# EAGLE design svd (EAGLE 6.6.0)
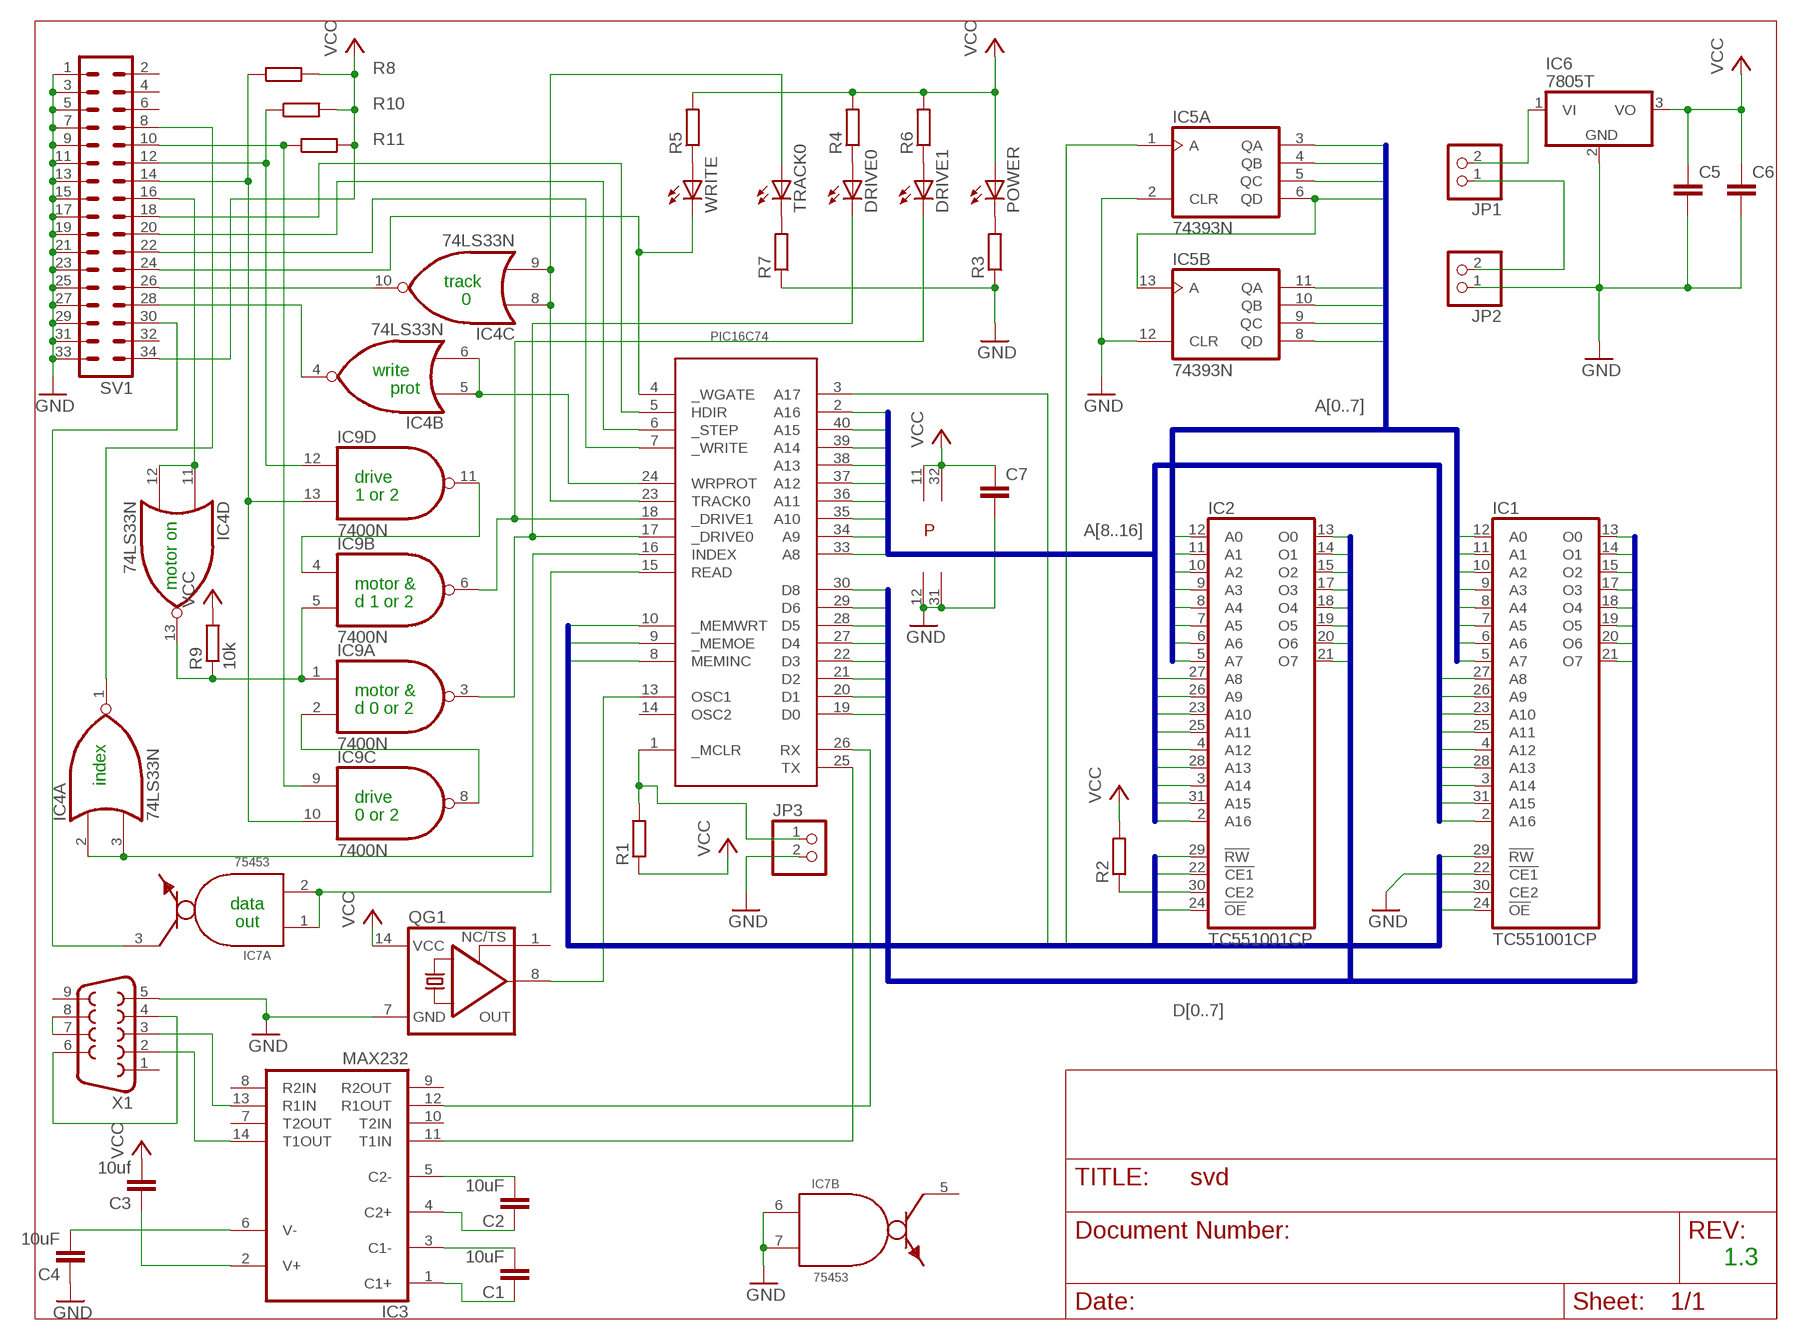
[diagram p0: schematic, sheet 1]

## Parts
C1  10uF  C2.5/5  [C2.5-5]
C2  10uF  C2.5/5  [C2.5-5]
C3  10uf  C2.5/5  [C2.5-5]
C4  10uF  C2.5/5  [C2.5-5]
C5  C5/5  [C5B5]
C6  C5/5  [C5B5]
C7  C2,5-3  [C2.5-3]
DRIVE0  LED3MM  [LED3MM]
DRIVE1  LED3MM  [LED3MM]
IC1  TC551001CP  [DIL32]
IC2  TC551001CP  [DIL32]
IC3  MAX232  [DIL16]
IC4  74LS33N  [DIL14]
IC5  74393N  [DIL14]
IC6  7805T  [TO220H]
IC7  75453  [DIL08]
IC9  7400N  [DIL14]
JP1  PINHD-1X2  [1X02]
JP2  PINHD-1X2  [1X02]
JP3  PINHD-1X2  [1X02]
PIC16C74  SVD-PIC16C74  [DIL40]
POWER  LED3MM  [LED3MM]
QG1  XO-14  [DIL14S]
R1  R-EU_0204/5  [0204/5]
R2  R-EU_0204/5  [0204/5]
R3  R-EU_0204/5  [0204/5]
R4  R-EU_0204/5  [0204/5]
R5  R-EU_0204/5  [0204/5]
R6  R-EU_0204/5  [0204/5]
R7  R-EU_0204/5  [0204/5]
R8  R-EU_0204/5  [0204/5]
R9  10k  R-EU_0204/5  [0204/5]
R10  R-EU_0204/5  [0204/5]
R11  R-EU_0204/5  [0204/5]
SV1  ML34  [ML34]
TRACK0  LED3MM  [LED3MM]
WRITE  LED3MM  [LED3MM]
X1  F09HP  [F09HP]

## Nets
!OE: IC1.24(!OE) IC2.24(!OE) PIC16C74.9(_MEMOE)
!WE: IC1.29(!RW) IC2.29(!RW) PIC16C74.10(_MEMWRT)
A0: IC1.12(A0) IC2.12(A0) IC5.3(A:QA)
A1: IC1.11(A1) IC2.11(A1) IC5.4(A:QB)
A2: IC1.10(A2) IC2.10(A2) IC5.5(A:QC)
A3: IC1.9(A3) IC2.9(A3) IC5.6(A:QD) IC5.13(B:A)
A4: IC1.8(A4) IC2.8(A4) IC5.11(B:QA)
A5: IC1.7(A5) IC2.7(A5) IC5.10(B:QB)
A6: IC1.6(A6) IC2.6(A6) IC5.9(B:QC)
A7: IC1.5(A7) IC2.5(A7) IC5.8(B:QD)
A8: IC1.27(A8) IC2.27(A8) PIC16C74.33(A8)
A9: IC1.26(A9) IC2.26(A9) PIC16C74.34(A9)
A10: IC1.23(A10) IC2.23(A10) PIC16C74.35(A10)
A11: IC1.25(A11) IC2.25(A11) PIC16C74.36(A11)
A12: IC1.4(A12) IC2.4(A12) PIC16C74.37(A12)
A13: IC1.28(A13) IC2.28(A13) PIC16C74.38(A13)
A14: IC1.3(A14) IC2.3(A14) PIC16C74.39(A14)
A15: IC1.31(A15) IC2.31(A15) PIC16C74.40(A15)
A16: IC1.2(A16) IC2.2(A16) PIC16C74.2(A16)
A17: IC1.30(CE2) IC2.22(!CE1) PIC16C74.3(A17)
CLK: IC5.1(A:A) PIC16C74.8(MEMINC)
D0: IC1.13(O0) IC2.13(O0) PIC16C74.19(D0)
D1: IC1.14(O1) IC2.14(O1) PIC16C74.20(D1)
D2: IC1.15(O2) IC2.15(O2) PIC16C74.21(D2)
D3: IC1.17(O3) IC2.17(O3) PIC16C74.22(D3)
D4: IC1.18(O4) IC2.18(O4) PIC16C74.27(D4)
D5: IC1.19(O5) IC2.19(O5) PIC16C74.28(D5)
D6: IC1.20(O6) IC2.20(O6) PIC16C74.29(D6)
D7: IC1.21(O7) IC2.21(O7) PIC16C74.30(D8)
GND: C4.1 C5.2 C6.2 C7.2 IC1.22(!CE1) IC5.2(A:CLR) IC5.12(B:CLR) IC6.2(GND) IC7.6(B:I0) IC7.7(B:I1) JP2.1 JP3.2 PIC16C74.12(GND) PIC16C74.31(GND) QG1.7(GND) R3.1 R7.1 SV1.1 SV1.3 SV1.5 SV1.7 SV1.9 SV1.11 SV1.13 SV1.15 SV1.17 SV1.19 SV1.21 SV1.23 SV1.25 SV1.27 SV1.29 SV1.31 SV1.33 X1.5
N$1: IC2.30(CE2) R2.1
N$2: JP3.1 PIC16C74.1(_MCLR) R1.2
N$3: C1.1 IC3.1(C1+)
N$4: C1.2 IC3.3(C1-)
N$5: C2.1 IC3.4(C2+)
N$6: C2.2 IC3.5(C2-)
N$7: C3.1 IC3.2(V+)
N$8: PIC16C74.13(OSC1) QG1.8(OUT)
N$9: IC3.12(R1OUT) PIC16C74.26(RX)
N$10: DRIVE1.K(C) IC9.6(B:O) PIC16C74.18(_DRIVE1)
N$11: IC4.11(D:I0) IC4.12(D:I1) SV1.16
N$12: IC9.12(D:I0) R10.1 SV1.12
N$13: IC4.13(D:O) IC9.1(A:I0) IC9.5(B:I1) R9.1
N$14: IC4.1(A:O) SV1.8
N$15: PIC16C74.4(_WGATE) SV1.24 WRITE.K(C)
N$16: PIC16C74.7(_WRITE) SV1.22
N$17: IC4.10(C:O) SV1.26
N$18: X1.7 X1.8
N$19: IC7.1(A:I0) IC7.2(A:I1) PIC16C74.15(READ)
N$20: IC9.4(B:I0) IC9.11(D:O)
N$22: IC4.8(C:I0) IC4.9(C:I1) PIC16C74.23(TRACK0) TRACK0.A
N$23: DRIVE0.K(C) IC9.3(A:O) PIC16C74.17(_DRIVE0)
N$24: IC3.11(T1IN) PIC16C74.25(TX)
N$25: IC3.13(R1IN) X1.3
N$26: X1.4 X1.6
N$27: IC3.14(T1OUT) X1.2
N$28: C4.2 IC3.6(V-)
N$29 [Output]: IC4.2(A:I0) IC4.3(A:I1) PIC16C74.16(INDEX)
N$30 [VCC]: IC6.1(VI) JP1.2
N$32: POWER.K(C) R3.2
N$33: DRIVE0.A R4.1
N$34: DRIVE1.A R6.1
N$35: R5.1 WRITE.A
N$36: R7.2 TRACK0.K(C)
N$38 [VCC]: JP1.1 JP2.2
N$40 [Output]: IC7.3(A:O) SV1.30
N$41: IC4.5(B:I0) IC4.6(B:I1) PIC16C74.24(WRPROT)
N$42: IC9.9(C:I0) R11.1 SV1.10
N$43: IC9.2(A:I1) IC9.8(C:O)
N$45: IC4.4(B:O) SV1.28
N$47: PIC16C74.6(_STEP) SV1.20
N$48: PIC16C74.5(HDIR) SV1.18
N$51: IC9.10(C:I1) IC9.13(D:I1) R8.1 SV1.14
VCC [VCC]: C3.2 C5.1 C6.1 C7.1 IC6.3(VO) PIC16C74.11(VCC) PIC16C74.32(VCC) POWER.A QG1.14(VCC) R1.1 R2.2 R4.2 R5.2 R6.2 R8.2 R9.2 R10.2 R11.2 SV1.34
Unconnected: IC1.1(NC) IC2.1(NC) IC3.7(T2OUT) IC3.8(R2IN) IC3.9(R2OUT) IC3.10(T2IN) IC7.5(B:O) PIC16C74.14(OSC2) QG1.1(TS) SV1.2 SV1.4 SV1.6 SV1.32 X1.1 X1.9

## Buses
D[0..7]
A[0..7]
A[8..16]
A17,!OE,!WE,CLK

## Notes on the sheet
- track
- 0
- write
- prot
- drive
- 1 or 2
- motor on | motor &
- d 1 or 2
- motor &
- d 0 or 2
- index
- drive
- 0 or 2
- data
- out
- 1.3

## Power pins joined to a net without a drawn wire
GND: IC1.16(GND) IC2.16(GND) IC3.15(GND) IC4.7(P:GND) IC5.7(P:GND) IC7.4(P:GND) IC9.7(P:GND)
VCC: IC1.32(VCC) IC2.32(VCC) IC3.16(VCC) IC4.14(P:VCC) IC5.14(P:VCC) IC7.8(P:VCC) IC9.14(P:VCC)

## Library data of the parts
C1-C7 = capacitor-wima:C: CAPACITOR naming: grid - package width
DRIVE0 DRIVE1 POWER TRACK0 WRITE = led:LED: LED OSRAM: - CHIPLED LG R971, LG N971, LY N971, LG Q971, LY Q971, LO R971, LY R971 LH N974, LH R974 LS Q976, LO Q976, LY Q976 LO Q996 - Hyper CHIPLED LW Q18S LB Q993, LB Q99A, LB R99A - SideLED LS A670, LO A670, LY A670, LG A670, LP A670 LB A673, LV A673, LT A673, LW A673 LH A674 LY A675 LS A676, LA A676, LO A676, LY A676, LW A676 LS A679, LY A679, LG A679 - Hyper Micro SIDELED® LS Y876, LA Y876, LO Y876, LY Y876 LT Y87S - SmartLED LW L88C, LW L88S LB L89C, LB L89S, LG L890 LS L89K, LO L89K, LY L89K LS L896, LA L896, LO L896, LY L896 - TOPLED LS T670, LO T670, LY T670, LG T670, LP T670 LSG T670, LSP T670, LSY T670, LOP T670, LYG T670 LG T671, LOG T671, LSG T671 LB T673, LV T673, LT T673, LW T673 LH T674 LS T676, LA T676, LO T676, LY T676, LB T676, LH T676, LSB T676, LW T676 LB T67C, LV T67C, LT T67C, LS T67K, LO T67K, LY T67K, LW E67C LS E67B, LA E67B, LO E67B, LY E67B, LB E67C, LV E67C, LT E67C LW T67C LS T679, LY T679, LG T679 LS T770, LO T770, LY T770, LG T770, LP T770 LB T773, LV T773, LT T773, LW T773 LH T774 LS E675, LA E675, LY E675, LS T675 LS T776, LA T776, LO T776, LY T776, LB T776 LHGB T686 LT T68C, LB T68C - Hyper Mini TOPLED® LB M676 - Mini TOPLED Santana® LG M470 LS M47K, LO M47K, LY M47K Source: http://www.osram.convergy.de LUXEON: - LUMILED® LXK2-PW12-R00, LXK2-PW12-S00, LXK2-PW14-U00, LXK2-PW14-V00 LXK2-PM12-R00, LXK2-PM12-S00, LXK2-PM14-U00 LXK2-PE12-Q00, LXK2-PE12-R00, LXK2-PE12-S00, LXK2-PE14-T00, LXK2-PE14-U00 LXK2-PB12-K00, LXK2-PB12-L00, LXK2-PB12-M00, LXK2-PB14-N00, LXK2-PB14-P00, LXK2-PB14-Q00 LXK2-PR12-L00, LXK2-PR12-M00, LXK2-PR14-Q00, LXK2-PR14-R00 LXK2-PD12-Q00, LXK2-PD12-R00, LXK2-PD12-S00 LXK2-PH12-R00, LXK2-PH12-S00 LXK2-PL12-P00, LXK2-PL12-Q00, LXK2-PL12-R00 Source: www.luxeon.com KINGBRIGHT: KA-3528ASYC Source: www.kingbright.com
IC1 IC2 = memory:TC551001CP: MEMORY
IC3 = maxim:MAX232: RS232 TRANSCEIVER; MF: MAXIM; MPN: MAX232ACPE+; OC_FARNELL: 9723773; OC_NEWARK: 68K4544
IC4 = 74xx-us:74*33: Quad 2-input NOR buffer, open collector
IC5 = 74xx-us:74*393: Dual 4-bit decade and binary COUNTER
IC6 = linear:78*: Positive VOLTAGE REGULATOR Source: http://cache.national.com/ds/LM/LM78L05.pdf http://www.fairchildsemi.com/ds/LM/LM7805.pdf
IC7 = Erics:75453: Dual NAND peripheral driver
IC9 = 74xx-us:74*00: Quad 2-input NAND gate
JP1-JP3 = pinhead:PINHD-1X2: PIN HEADER
PIC16C74 = Erics:SVD-PIC16C74
QG1 = crystal:XO-: CRYSTAL; OC_FARNELL: unknown; OC_NEWARK: unknown
R1-R11 = rcl:R-EU_: RESISTOR, European symbol
SV1 = con-harting-ml:ML34: HARTING; OC_FARNELL: unknown; OC_NEWARK: unknown
X1 = con-subd:F09: SUB-D; OC_FARNELL: unknown; OC_NEWARK: unknown

## Net classes
1 VCC: width 0.635 mm
2 GND: width 0.635 mm
3 Output: width 0.635 mm

## Board
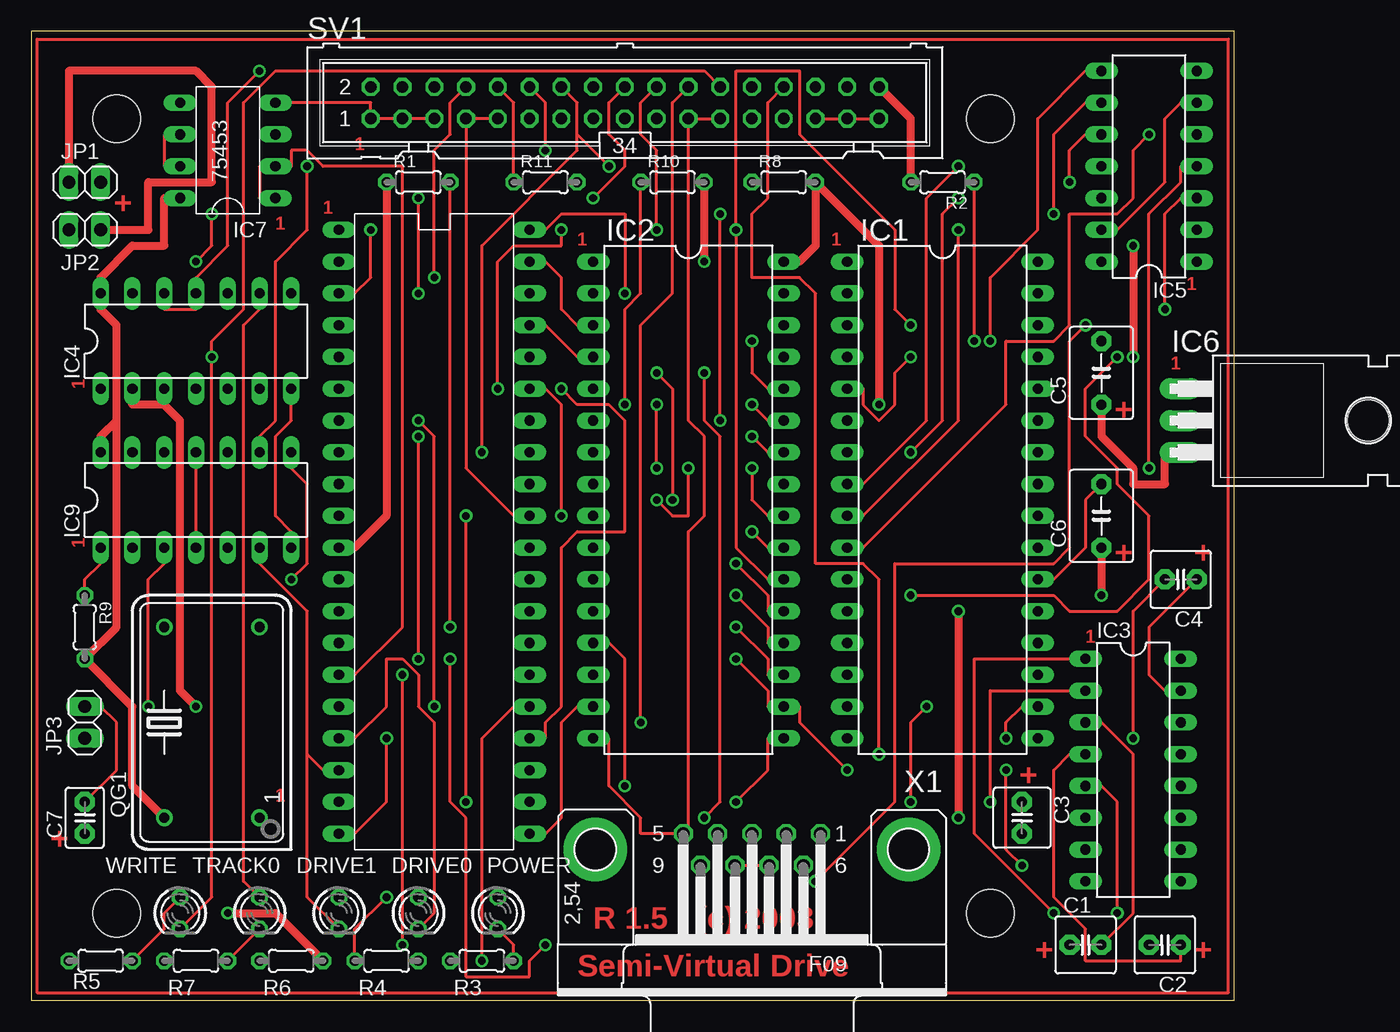
[diagram p1: board, top side]
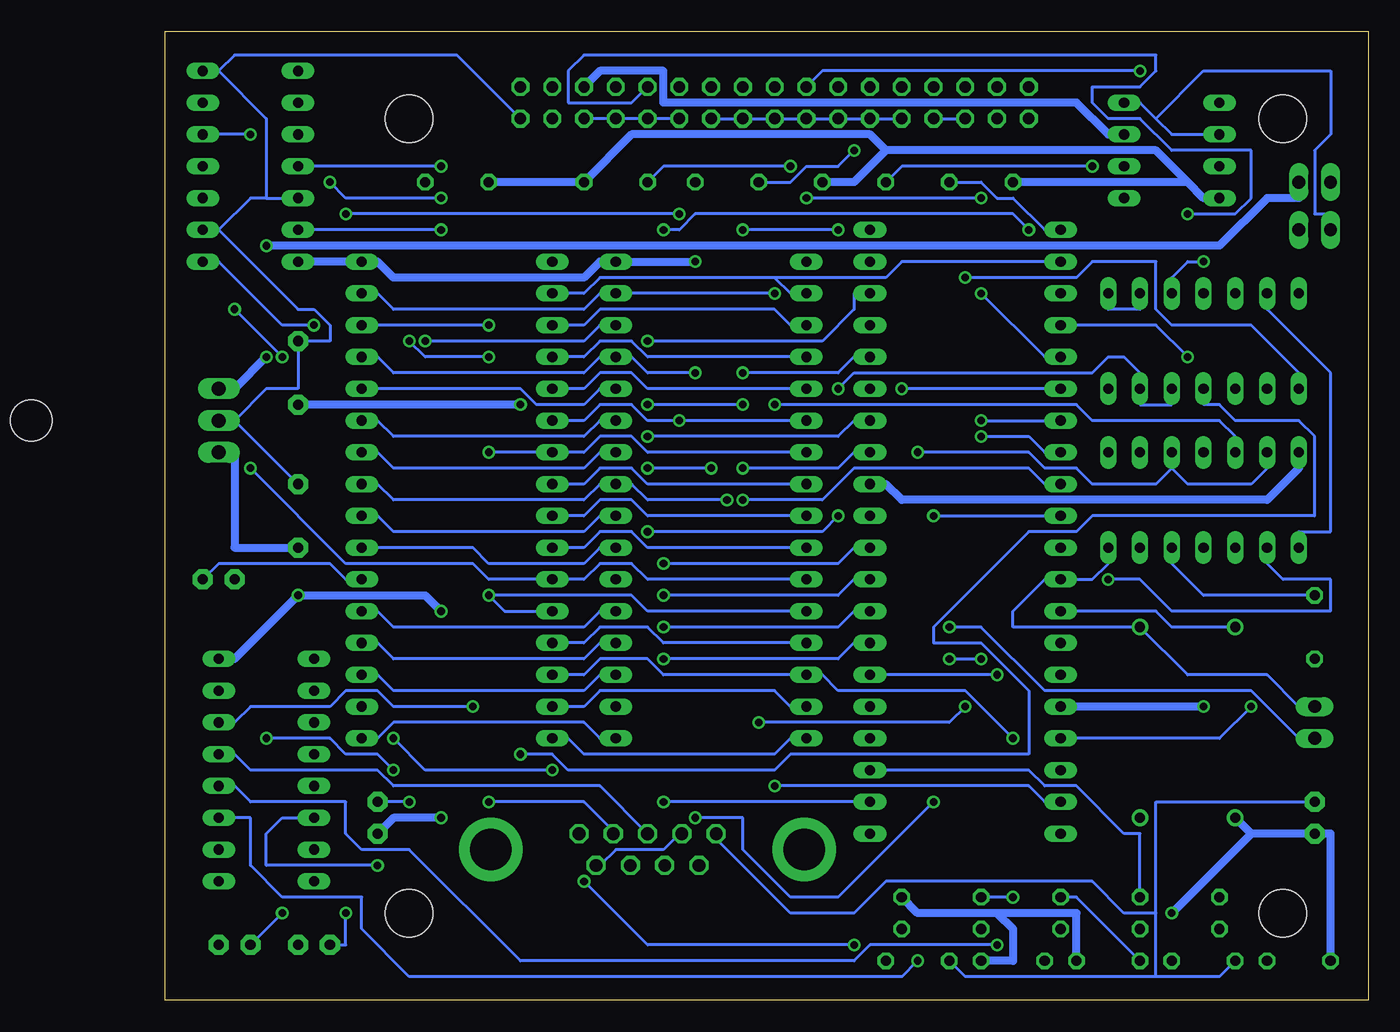
[diagram p2: board, bottom side, seen from below]

Size 96.19 x 77.46 mm. Coordinates in mm from the lower left corner, seen from the top.
Outline: 0,0 96.19,0 96.19,77.46 0,77.46 0,0
Copper layers (1*16): Top 0.035mm / dielectric 1.5mm / Bottom 0.035mm
Design rules "default": minimum track width 10mil, minimum drill 24mil, track to track 8mil, track to pad 8mil, pad to pad 8mil, via to via 8mil, smd to smd 8mil, copper to edge 40mil, drill to drill 8mil, minimum pad ring 10mil, minimum via ring 8mil, stop-mask expansion 4mil, vias tented up to drill 0mil, thermal gap 10mil
Holes 3.81 mm at 6.82,6.98 6.82,70.48 76.67,70.48 76.67,6.98

### Footprints (pad centres in the part's own frame; a part is rotated, then mirrored left to right if it is on the bottom)
C2.5-5 = drill 0.813 pad 1.6 octagon: 1 -1.27,0; 2 1.27,0
C5B5 = drill 0.813 pad 1.6 octagon: 1 -2.54,0; 2 2.54,0
C2.5-3 = drill 0.813 pad 1.6 octagon: 1 -1.27,0; 2 1.27,0
LED3MM = drill 0.813 octagon: A -1.27,0; K 1.27,0
DIL32 = drill 0.813 long: 1 -19.05,-7.62; 2 -16.51,-7.62; 3 -13.97,-7.62; 4 -11.43,-7.62; 5 -8.89,-7.62; 6 -6.35,-7.62; 7 -3.81,-7.62; 8 -1.27,-7.62; 9 1.27,-7.62; 10 3.81,-7.62; 11 6.35,-7.62; 12 8.89,-7.62; 13 11.43,-7.62; 14 13.97,-7.62; 15 16.51,-7.62; 16 19.05,-7.62; 17 19.05,7.62; 18 16.51,7.62; 19 13.97,7.62; 20 11.43,7.62; 21 8.89,7.62; 22 6.35,7.62; 23 3.81,7.62; 24 1.27,7.62; 25 -1.27,7.62; 26 -3.81,7.62; 27 -6.35,7.62; 28 -8.89,7.62; 29 -11.43,7.62; 30 -13.97,7.62; 31 -16.51,7.62; 32 -19.05,7.62
DIL16 = drill 0.813 long: 1 -8.89,-3.81; 2 -6.35,-3.81; 3 -3.81,-3.81; 4 -1.27,-3.81; 5 1.27,-3.81; 6 3.81,-3.81; 7 6.35,-3.81; 8 8.89,-3.81; 9 8.89,3.81; 10 6.35,3.81; 11 3.81,3.81; 12 1.27,3.81; 13 -1.27,3.81; 14 -3.81,3.81; 15 -6.35,3.81; 16 -8.89,3.81
DIL14 = drill 0.813 long: 1 -7.62,-3.81; 2 -5.08,-3.81; 3 -2.54,-3.81; 4 0,-3.81; 5 2.54,-3.81; 6 5.08,-3.81; 7 7.62,-3.81; 8 7.62,3.81; 9 5.08,3.81; 10 2.54,3.81; 11 0,3.81; 12 -2.54,3.81; 13 -5.08,3.81; 14 -7.62,3.81
TO220H = drill 1.118 long: 1 -2.54,-10.16; 2 0,-10.16; 3 2.54,-10.16 | hole 3.302: 0,4.826
DIL08 = drill 0.813 long: 1 -3.81,-3.81; 2 -1.27,-3.81; 3 1.27,-3.81; 4 3.81,-3.81; 5 3.81,3.81; 6 1.27,3.81; 7 -1.27,3.81; 8 -3.81,3.81
1X02 = drill 1.016 long: 1 -1.27,0; 2 1.27,0
DIL40 = drill 0.813 long: 1 -17.78,-12.7; 2 -15.24,-12.7; 3 -12.7,-12.7; 4 -10.16,-12.7; 5 -7.62,-12.7; 6 -5.08,-12.7; 7 -2.54,-12.7; 8 0,-12.7; 9 2.54,-12.7; 10 5.08,-12.7; 11 7.62,-12.7; 12 10.16,-12.7; 13 12.7,-12.7; 14 15.24,-12.7; 15 17.78,-12.7; 16 20.32,-12.7; 17 22.86,-12.7; 18 25.4,-12.7; 19 27.94,-12.7; 20 30.48,-12.7; 21 30.48,2.54; 22 27.94,2.54; 23 25.4,2.54; 24 22.86,2.54; 25 20.32,2.54; 26 17.78,2.54; 27 15.24,2.54; 28 12.7,2.54; 29 10.16,2.54; 30 7.62,2.54; 31 5.08,2.54; 32 2.54,2.54; 33 0,2.54; 34 -2.54,2.54; 35 -5.08,2.54; 36 -7.62,2.54; 37 -10.16,2.54; 38 -12.7,2.54; 39 -15.24,2.54; 40 -17.78,2.54
DIL14S = drill 0.813: 1 -7.62,-3.81; 7 7.62,-3.81; 8 7.62,3.81; 14 -7.62,3.81
0204/5 = drill 0.813 octagon: 1 -2.54,0; 2 2.54,0
ML34 = drill 0.914 octagon: 1 -20.32,-1.27; 2 -20.32,1.27; 3 -17.78,-1.27; 4 -17.78,1.27; 5 -15.24,-1.27; 6 -15.24,1.27; 7 -12.7,-1.27; 8 -12.7,1.27; 9 -10.16,-1.27; 10 -10.16,1.27; 11 -7.62,-1.27; 12 -7.62,1.27; 13 -5.08,-1.27; 14 -5.08,1.27; 15 -2.54,-1.27; 16 -2.54,1.27; 17 0,-1.27; 18 0,1.27; 19 2.54,-1.27; 20 2.54,1.27; 21 5.08,-1.27; 22 5.08,1.27; 23 7.62,-1.27; 24 7.62,1.27; 25 10.16,-1.27; 26 10.16,1.27; 27 12.7,-1.27; 28 12.7,1.27; 29 15.24,-1.27; 30 15.24,1.27; 31 17.78,-1.27; 32 17.78,1.27; 33 20.32,-1.27; 34 20.32,1.27
F09HP = drill 1.016 octagon: 1 -5.486,-1.27; 2 -2.743,-1.27; 3 0,-1.27; 4 2.743,-1.27; 5 5.486,-1.27; 6 -4.115,1.27; 7 -1.372,1.27; 8 1.372,1.27; 9 4.115,1.27 | drill 3.302 pad 5.08: G1 -12.522,0; G2 12.522,0

### Placement (x,y rotation side)
C1  84.29,4.44 0 top
C2  90.64,4.44 180 top
C3  79.21,14.6 270 top
C4  91.91,33.65 180 top
C5  85.56,50.16 90 top
C6  85.56,38.73 90 top
C7  4.28,14.6 90 top
DRIVE0  30.95,6.98 270 top
DRIVE1  24.6,6.98 270 top
IC1  72.86,40 270 top
IC2  52.54,40 270 top
IC3  88.1,18.41 270 top
IC4  13.17,52.7 0 top
IC5  89.37,66.67 90 top
IC6  102.07,46.35 270 top
IC7  15.71,67.94 90 top
IC9  13.17,40 0 top
JP1  4.28,65.4 0 top
JP2  4.28,61.59 0 top
JP3  4.28,22.22 90 top
PIC16C74  37.3,43.81 270 top
POWER  37.3,6.98 270 top
QG1  14.44,22.22 90 top
R1  30.95,65.4 0 top
R2  72.86,65.4 180 top
R3  36.03,3.17 0 top
R4  28.41,3.17 0 top
R5  5.55,3.17 180 top
R6  20.79,3.17 0 top
R7  13.17,3.17 0 top
R8  60.16,65.4 0 top
R9  4.28,29.84 270 top
R10  51.27,65.4 0 top
R11  41.11,65.4 0 top
SV1  47.46,71.75 0 top
TRACK0  18.25,6.98 270 top
WRITE  11.9,6.98 270 top
X1  57.62,12.06 180 top

### Tracks (layer width: path | path; a pad name or v marks a point on that pad's centre or on a via)
!OE  (via drill 0.61)
  Top 0.254: v50,40 51.27,38.73 52.54,38.73 v52.54,42.54 | v57.62,42.54 57.62,40 58.89,38.73 IC2.24
  Bottom 0.254: IC2.24 61.43,38.73 62.7,37.46 77.94,37.46 79.21,38.73 IC1.24 | v50,40 43.65,40 41.11,42.54 27.14,42.54 25.87,41.27 PIC16C74.9 | v52.54,42.54 v57.62,42.54
!WE  (via drill 0.61)
  Top 0.254: v34.76,15.87 v34.76,38.73 | v53.81,14.6 55.08,15.87 55.08,45.08 53.81,46.35 v53.81,50.16
  Bottom 0.254: v34.76,15.87 42.38,8.25 46.19,8.25 50,12.06 50,14.6 v53.81,14.6 | v53.81,50.16 57.62,50.16 58.89,51.43 IC2.29 61.43,51.43 62.7,50.16 77.94,50.16 79.21,51.43 IC1.29 | v34.76,38.73 PIC16C74.10
A0  (via drill 0.61)
  Top 0.254: v90.64,55.24 90.64,62.86 91.91,64.13 IC5.3 | v86.83,51.43 84.29,48.89 84.29,45.08 86.83,42.54 86.83,41.27 89.37,38.73 89.37,33.65 86.83,31.11 83.02,31.11 81.75,32.38 v70.32,32.38
  Bottom 0.254: v86.83,51.43 v90.64,55.24 | IC1.12 69.05,31.11 v70.32,32.38 58.89,32.38 57.62,31.11 IC2.12
A1  (via drill 0.61)
  Top 0.254: v89.37,42.54 89.37,62.86 91.91,65.4 91.91,66.67 IC5.4
  Bottom 0.254: v89.37,42.54 81.75,34.92 71.59,34.92 70.32,33.65 IC1.11 62.7,33.65 61.43,34.92 58.89,34.92 57.62,33.65 IC2.11
A2  (via drill 0.61)
  Top 0.254: v89.37,69.21 88.1,67.94 88.1,64.13 86.83,62.86 83.02,62.86 83.02,53.97 81.75,52.7 77.94,52.7 77.94,47.62 66.51,36.19 IC1.10
  Bottom 0.254: v89.37,69.21 IC5.5 | IC2.10 57.62,36.19 58.89,37.46 61.43,37.46 62.7,36.19 IC1.10
A3  (via drill 0.61)
  Top 0.254: IC5.13 86.83,61.59 90.64,65.4 90.64,70.48 91.91,71.75 IC5.6 | v74.13,61.59 74.13,46.35 66.51,38.73 IC1.9
  Bottom 0.254: IC2.9 57.62,38.73 58.89,40 61.43,40 62.7,38.73 IC1.9 | v74.13,61.59 IC5.13
A4  (via drill 0.61)
  Top 0.254: v74.13,66.67 71.59,64.13 71.59,46.35 66.51,41.27 IC1.8
  Bottom 0.254: v74.13,66.67 IC5.11 | IC2.8 57.62,41.27 58.89,42.54 61.43,42.54 62.7,41.27 IC1.8
A5  (via drill 0.61)
  Top 0.254: v83.02,65.4 83.02,67.94 84.29,69.21 IC5.10 | v74.13,64.13 72.86,62.86 72.86,46.35 v70.32,43.81
  Bottom 0.254: v83.02,65.4 81.75,64.13 v74.13,64.13 | v70.32,43.81 IC1.7 62.7,43.81 61.43,45.08 58.89,45.08 57.62,43.81 IC2.7
A6  (via drill 0.61)
  Top 0.254: v81.75,62.86 81.75,69.21 84.29,71.75 IC5.9 | v55.08,46.35 v55.08,62.86
  Bottom 0.254: v55.08,62.86 v81.75,62.86 | IC2.6 v55.08,46.35 57.62,46.35 58.89,47.62 61.43,47.62 62.7,46.35 IC1.6
A7  (via drill 0.61)
  Top 0.254: v76.67,52.7 76.67,57.78 80.48,61.59 80.48,70.48 84.29,74.29 IC5.8 | v70.32,51.43 69.05,50.16 69.05,47.62 67.78,46.35 66.51,47.62 66.51,48.89 IC1.5
  Bottom 0.254: v76.67,52.7 75.4,51.43 v70.32,51.43 | IC2.5 57.62,48.89 58.89,50.16 61.43,50.16 62.7,48.89 IC1.5
A8  (via drill 0.61)
  Top 0.254: v50,42.54 v50,47.62 | v57.62,47.62 58.89,46.35 IC2.27
  Bottom 0.254: v50,42.54 42.38,42.54 41.11,43.81 PIC16C74.33 | v50,47.62 v57.62,47.62 | IC1.27 79.21,46.35 77.94,45.08 62.7,45.08 61.43,46.35 IC2.27
A9  (via drill 0.61)
  Top 0.254: v57.62,45.08 58.89,43.81 IC2.26
  Bottom 0.254: IC2.26 61.43,43.81 62.7,42.54 77.94,42.54 79.21,43.81 IC1.26 | v57.62,45.08 42.38,45.08 41.11,46.35 PIC16C74.34
A10  (via drill 0.61)
  Top 0.254: v42.38,38.73 42.38,47.62 41.11,48.89 PIC16C74.35 | v57.62,37.46 58.89,36.19 IC2.23
  Bottom 0.254: IC2.23 61.43,36.19 62.7,34.92 70.32,34.92 71.59,36.19 IC1.23 | v42.38,38.73 43.65,37.46 v57.62,37.46
A11  (via drill 0.61)
  Top 0.254: v50,50.16 51.27,48.89 v51.27,40
  Bottom 0.254: IC1.25 79.21,41.27 77.94,40 62.7,40 61.43,41.27 IC2.25 58.89,41.27 57.62,40 v51.27,40 | v50,50.16 42.38,50.16 41.11,51.43 PIC16C74.36
A12
  Top 0.254: IC2.4 43.65,51.43 41.11,53.97 PIC16C74.37
  Bottom 0.254: IC1.4 62.7,51.43 61.43,52.7 58.89,52.7 57.62,51.43 IC2.4
A13  (via drill 0.61)
  Top 0.254: v57.62,52.7 57.62,50.16 58.89,48.89 IC2.28
  Bottom 0.254: IC2.28 61.43,48.89 62.7,47.62 66.51,47.62 67.78,48.89 IC1.28 | v57.62,52.7 43.65,52.7 41.11,55.24 41.11,56.51 PIC16C74.38
A14
  Top 0.254: IC2.3 43.65,53.97 42.38,55.24 42.38,57.78 41.11,59.05 PIC16C74.39
  Bottom 0.254: IC1.3 62.7,53.97 61.43,55.24 47.46,55.24 46.19,53.97 IC2.3
A15  (via drill 0.61)
  Top 0.254: v47.46,56.51 47.46,62.86 42.38,62.86 41.11,61.59 PIC16C74.40
  Bottom 0.254: IC1.31 79.21,56.51 77.94,55.24 62.7,55.24 61.43,56.51 IC2.31 v47.46,56.51
A16
  Bottom 0.254: 47.46,57.78 46.19,56.51 IC2.2 | 47.46,57.78 61.43,57.78 62.7,56.51 IC1.2 | 47.46,57.78 38.57,57.78 37.3,59.05 PIC16C74.2
A17  (via drill 0.61)
  Top 0.254: v27.14,61.59 27.14,57.78 25.87,56.51 PIC16C74.3 | IC2.22 58.89,33.65 56.35,36.19 v56.35,61.59 56.35,74.29 61.43,74.29 61.43,69.21 69.05,61.59 69.05,55.24 v70.32,53.97
  Bottom 0.254: v27.14,61.59 28.41,62.86 53.81,62.86 55.08,61.59 v56.35,61.59 | v70.32,53.97 IC1.30
CLK  (via drill 0.61)
  Top 0.254: v84.29,53.97 83.02,52.7 83.02,36.19 81.75,34.92 69.05,34.92 69.05,15.87 v62.7,9.52 | v41.11,4.44 39.84,3.17 39.84,1.9 34.76,1.9 34.76,14.6 33.49,15.87 v33.49,27.3 | v30.95,27.3 v30.95,45.08
  Bottom 0.254: v84.29,53.97 86.83,53.97 91.91,59.05 IC5.1 | v62.7,9.52 57.62,4.44 v41.11,4.44 | v33.49,27.3 v30.95,27.3 | v30.95,45.08 27.14,45.08 25.87,43.81 PIC16C74.8
D0  (via drill 0.61)
  Top 0.254: v47.46,17.14 47.46,27.3 46.19,28.57 IC2.13
  Bottom 0.254: v47.46,17.14 27.14,17.14 25.87,15.87 PIC16C74.19 | IC1.13 62.7,28.57 61.43,29.84 57.62,29.84 56.35,28.57 IC2.13
D1  (via drill 0.61)
  Top 0.254: v28.41,20.95 28.41,15.87 25.87,13.33 PIC16C74.20
  Bottom 0.254: v28.41,20.95 32.22,24.76 42.38,24.76 43.65,26.03 IC2.14 56.35,26.03 57.62,27.3 61.43,27.3 62.7,26.03 IC1.14
D2
  Top 0.254: PIC16C74.21 41.11,13.33 42.38,14.6 42.38,22.22 43.65,23.49 IC2.15
  Bottom 0.254: IC1.15 62.7,23.49 61.43,24.76 47.46,24.76 46.19,23.49 IC2.15
D3  (via drill 0.61)
  Top 0.254: v56.35,15.87 58.89,18.41 58.89,20.95 IC2.17
  Bottom 0.254: PIC16C74.22 v56.35,15.87 | IC1.17 79.21,20.95 77.94,22.22 62.7,22.22 61.43,20.95 IC2.17
D4  (via drill 0.61)
  Top 0.254: v56.35,27.3 58.89,24.76 58.89,23.49 IC2.18 61.43,23.49 61.43,22.22 v65.24,18.41 | v77.94,20.95 77.94,22.22 79.21,23.49 IC1.18
  Bottom 0.254: v56.35,27.3 42.38,27.3 41.11,28.57 PIC16C74.27 | v77.94,20.95 75.4,18.41 v65.24,18.41
D5  (via drill 0.61)
  Top 0.254: v56.35,29.84 58.89,27.3 58.89,26.03 IC2.19
  Bottom 0.254: IC2.19 61.43,26.03 62.7,24.76 77.94,24.76 79.21,26.03 IC1.19 | v56.35,29.84 42.38,29.84 41.11,31.11 PIC16C74.28
D6  (via drill 0.61)
  Top 0.254: v56.35,32.38 58.89,29.84 58.89,28.57 IC2.20
  Bottom 0.254: IC2.20 61.43,28.57 62.7,27.3 77.94,27.3 79.21,28.57 IC1.20 | v56.35,32.38 42.38,32.38 41.11,33.65 PIC16C74.29
D7  (via drill 0.61)
  Top 0.254: v56.35,34.92 58.89,32.38 58.89,31.11 IC2.21
  Bottom 0.254: IC2.21 61.43,31.11 62.7,29.84 77.94,29.84 79.21,31.11 IC1.21 | v56.35,34.92 42.38,34.92 41.11,36.19 PIC16C74.30
GND
  Top 0.254: IC2.16 46.19,20.95 46.19,17.14 48.73,14.6 48.73,13.33 X1.5 52.54,13.33 52.54,37.46 53.81,38.73 53.81,45.08 52.54,46.35 SV1.21 SV1.23 | IC4.7 20.79,46.35 19.52,45.08 19.52,38.73 20.79,37.46 IC9.7 | C7.2 6.82,18.41 6.82,22.22 5.55,23.49 JP3.2 | C4.1 89.37,29.84 89.37,26.03 90.64,24.76 IC3.15 | C6.2 84.29,40 84.29,36.19 81.75,33.65 IC1.22 | IC7.7 10.63,66.67 10.63,69.21 IC7.6 | SV1.29 SV1.31 SV1.33 | SV1.5 SV1.3 SV1.1 27.14,71.75 IC7.4 | PIC16C74.31 38.57,38.73 34.76,42.54 SV1.7 SV1.9
  Bottom 0.254: IC2.16 46.19,20.95 47.46,19.68 62.7,19.68 63.97,20.95 IC1.16 | R7.1 11.9,1.9 16.98,1.9 | 16.98,1.9 32.22,1.9 R3.1 | IC9.7 20.79,34.92 22.06,33.65 PIC16C74.12 25.87,33.65 28.41,31.11 28.41,29.84 QG1.7 14.44,26.03 8.09,26.03 5.55,23.49 JP3.2 | 16.98,6.98 16.98,15.87 C7.2 | 16.98,1.9 16.98,6.98 | 16.98,6.98 19.52,6.98 22.06,9.52 38.57,9.52 41.11,6.98 46.19,6.98 52.54,13.33 X1.5 | 91.91,61.59 89.37,64.13 88.1,64.13 | 88.1,64.13 IC5.12 | 91.91,74.29 88.1,70.48 88.1,64.13 | 90.64,46.35 88.1,48.89 85.56,48.89 C5.2 83.02,52.7 83.02,53.97 84.29,55.24 85.56,55.24 91.91,61.59 | C4.1 91.91,34.92 83.02,34.92 81.75,33.65 IC1.22 | 90.64,46.35 C6.2 | 90.64,46.35 IC6.2 | 91.91,61.59 IC5.2 | 16.98,70.48 15.71,69.21 IC7.6 | 16.98,70.48 18.25,71.75 IC7.4 | 16.98,70.48 13.17,74.29 3.01,74.29 3.01,69.21 4.28,67.94 4.28,62.86 3.01,62.86 JP2.1 | SV1.23 SV1.25 SV1.27 SV1.29 | SV1.9 SV1.11 SV1.13 SV1.15 SV1.17 SV1.19 SV1.21 | SV1.7 SV1.5 | 91.91,74.29 90.64,75.56 72.86,75.56 SV1.33 | 91.91,74.29 IC5.7
N$1  (via drill 0.61)
  Top 0.254: v75.4,52.7 R2.1
  Bottom 0.254: v75.4,52.7 62.7,52.7 61.43,53.97 IC2.30
N$2  (via drill 0.61)
  Top 0.254: v33.49,29.84 R1.2
  Bottom 0.254: R1.2 30.95,65.4 29.68,64.13 28.41,64.13 25.87,61.59 PIC16C74.1 | v33.49,29.84 30.95,29.84 25.87,24.76 9.36,24.76 5.55,20.95 JP3.1
N$3  (via drill 0.61)
  Top 0.254: v81.75,6.98 75.4,13.33 75.4,27.3 IC3.1
  Bottom 0.254: v81.75,6.98 81.75,4.44 C1.1
N$4
  Top 0.254: C1.2 88.1,6.98 88.1,19.68 85.56,22.22 IC3.3
N$5
  Top 0.254: C2.1 91.91,3.17 84.29,3.17 84.29,5.71 81.75,8.25 81.75,18.41 83.02,19.68 IC3.4
N$6  (via drill 0.61)
  Top 0.254: v86.83,6.98 86.83,15.87 85.56,17.14 IC3.5
  Bottom 0.254: C2.2 v86.83,6.98
N$7  (via drill 0.61)
  Top 0.254: v76.67,15.87 76.67,24.76 IC3.2
  Bottom 0.254: v76.67,15.87 C3.1
N$8
  Bottom 0.254: QG1.8 15.71,29.84 16.98,31.11 PIC16C74.13
N$9  (via drill 0.61)
  Top 0.254: v29.68,4.44 v29.68,26.03
  Bottom 0.254: v29.68,4.44 39.84,4.44 41.11,3.17 67.78,3.17 76.67,12.06 80.48,12.06 81.75,13.33 81.75,15.87 89.37,15.87 90.64,17.14 IC3.12 | v29.68,26.03 PIC16C74.26
N$10
  Top 0.254: 22.06,19.68 22.06,31.11 18.25,34.92 IC9.6 | 22.06,19.68 23.33,18.41 PIC16C74.18 | DRIVE1.K 22.06,8.25 22.06,19.68
N$11  (via drill 0.61)
  Top 0.254: IC4.12 10.63,55.24 13.17,55.24 IC4.11 13.17,57.78 15.71,60.32 15.71,71.75 v18.25,74.29
  Bottom 0.254: SV1.16 43.65,74.29 v18.25,74.29
N$12  (via drill 0.61)
  Top 0.254: v47.46,47.62 47.46,55.24 48.73,56.51 R10.1 | SV1.12 41.11,71.75 v41.11,67.94
  Bottom 0.254: v47.46,47.62 23.33,47.62 22.06,46.35 11.9,46.35 10.63,45.08 IC9.12 | v41.11,67.94 42.38,66.67 44.92,66.67 46.19,65.4 R10.1
N$13
  Top 0.254: R9.1 4.28,33.65 5.55,34.92 IC9.1
  Bottom 0.254: R9.1 13.17,32.38 15.71,34.92 IC9.5 | IC4.13 8.09,55.24 3.01,50.16 3.01,37.46 5.55,37.46 IC9.1
N$14  (via drill 0.61)
  Top 0.254: v32.22,57.78 32.22,67.94 33.49,69.21 33.49,71.75 SV1.8
  Bottom 0.254: v32.22,57.78 23.33,57.78 22.06,59.05 16.98,59.05 16.98,55.24 15.71,53.97 9.36,53.97 5.55,50.16 IC4.1
N$15  (via drill 0.61)
  Top 0.254: WRITE.K 14.44,8.25 v14.44,51.43 14.44,52.7 16.98,55.24 16.98,71.75 19.52,74.29 53.81,74.29 SV1.24
  Bottom 0.254: v14.44,51.43 16.98,53.97 PIC16C74.4
N$16  (via drill 0.61)
  Top 0.254: v30.95,46.35 32.22,45.08 v32.22,23.49 | v48.73,22.22 48.73,53.97 51.27,56.51 51.27,71.75 SV1.22
  Bottom 0.254: v32.22,23.49 33.49,22.22 v48.73,22.22 | v30.95,46.35 PIC16C74.7
N$17  (via drill 0.61)
  Top 0.254: v13.17,59.05 14.44,60.32 v14.44,62.86
  Bottom 0.254: v13.17,59.05 14.44,59.05 15.71,57.78 IC4.10 | v14.44,62.86 10.63,62.86 9.36,64.13 9.36,67.94 15.71,67.94 18.25,70.48 20.79,70.48 22.06,71.75 22.06,73.02 18.25,73.02 16.98,74.29 16.98,75.56 62.7,75.56 63.97,74.29 63.97,71.75 58.89,71.75 SV1.26
N$18
  Top 0.254: X1.8 X1.7
N$19
  Top 0.254: IC7.1 18.25,64.13 18.25,66.67 IC7.2 20.79,66.67 20.79,67.94 22.06,67.94 23.33,66.67 29.68,66.67 29.68,29.84 25.87,26.03 PIC16C74.15
N$20
  Top 0.254: IC9.4 IC9.11
N$22
  Top 0.254: TRACK0.A 16.98,9.52 16.98,53.97 18.25,55.24 IC4.9
  Bottom 0.254: IC4.9 18.25,55.24 20.79,55.24 IC4.8 | TRACK0.A 18.25,13.33 19.52,13.33 23.33,17.14 25.87,17.14 27.14,18.41 PIC16C74.23
N$23  (via drill 0.61)
  Top 0.254: v9.36,23.49 9.36,33.65 10.63,34.92 IC9.3 | DRIVE0.K 32.22,6.98 32.22,22.22 30.95,23.49 30.95,26.03 29.68,27.3 28.41,27.3 28.41,23.49 25.87,20.95 PIC16C74.17
  Bottom 0.254: v9.36,23.49 11.9,20.95 PIC16C74.17
N$24  (via drill 0.61)
  Top 0.254: v36.03,3.17 36.03,20.95 38.57,23.49 PIC16C74.25
  Bottom 0.254: v36.03,3.17 37.3,1.9 76.67,1.9 80.48,5.71 80.48,8.25 86.83,8.25 89.37,10.79 89.37,14.6 IC3.11
N$25
  Bottom 0.254: X1.3 61.43,17.14 77.94,17.14 79.21,18.41 89.37,18.41 90.64,19.68 IC3.13
N$26
  Bottom 0.254: X1.4 55.08,13.33 56.35,12.06 60.16,12.06 61.43,10.79 X1.6
N$27  (via drill 0.61)
  Top 0.254: v71.59,23.49 70.32,22.22 v70.32,15.87
  Bottom 0.254: v71.59,23.49 77.94,23.49 79.21,24.76 81.75,24.76 83.02,23.49 89.37,23.49 90.64,22.22 IC3.14 | v70.32,15.87 62.7,15.87 60.16,13.33 X1.2
N$28  (via drill 0.61)
  Top 0.254: v79.21,10.79 77.94,12.06 v77.94,18.41 | v88.1,20.95 88.1,31.11 C4.2
  Bottom 0.254: v79.21,10.79 88.1,10.79 88.1,13.33 86.83,14.6 IC3.6 | v77.94,18.41 79.21,19.68 81.75,19.68 83.02,20.95 v88.1,20.95
N$29  (via drill 0.61)
  Top 0.635: 10.63,47.62 8.09,47.62 IC4.2 | v13.17,23.49 11.9,24.76 11.9,46.35 10.63,47.62 | 10.63,47.62 IC4.3
  Bottom 0.635: v13.17,23.49 PIC16C74.16
N$30  (via drill 0.61)
  Top 0.635: v88.1,60.32 v88.1,51.43
  Bottom 0.635: v88.1,60.32 11.9,60.32 8.09,64.13 5.55,64.13 JP1.2 | v88.1,51.43 90.64,48.89 IC6.1
N$32
  Top 0.254: POWER.K 38.57,4.44 R3.2
N$33  (via drill 0.61)
  Top 0.254: v28.41,8.25 25.87,5.71 R4.1
  Bottom 0.254: v28.41,8.25 DRIVE0.A
N$34
  Bottom 0.254: DRIVE1.A 23.33,8.25 R6.1
N$35
  Top 0.254: WRITE.A 10.63,6.98 10.63,5.71 R5.1
N$36
  Top 0.254: R7.2 TRACK0.K
N$37
  Top 0.254: 0.47,76.83 95.72,76.83 95.72,0.63 0.47,0.63 0.47,76.83
N$38
  Top 0.635: JP2.2 9.36,61.59 9.36,65.4 14.44,65.4 14.44,73.02 13.17,74.29 3.01,74.29 JP1.1
N$40
  Bottom 0.635: SV1.30 61.43,74.29 56.35,74.29 56.35,71.75 23.33,71.75 20.79,69.21 IC7.3
N$41  (via drill 0.61)
  Top 0.254: v42.38,48.89 43.65,47.62 46.19,47.62 47.46,46.35 47.46,37.46 43.65,37.46 42.38,36.19 42.38,23.49 41.11,22.22 41.11,20.95 PIC16C74.24
  Bottom 0.254: IC4.5 15.71,47.62 18.25,47.62 IC4.6 18.25,50.16 19.52,51.43 20.79,51.43 22.06,50.16 41.11,50.16 v42.38,48.89
N$42  (via drill 0.61)
  Top 0.254: v22.06,66.67 22.06,61.59 19.52,59.05 19.52,46.35 18.25,45.08 IC9.9 | SV1.10 38.57,71.75 R11.1
  Bottom 0.254: v22.06,66.67 37.3,66.67 R11.1
N$43  (via drill 0.61)
  Top 0.254: v20.79,33.65 22.06,34.92 22.06,41.27 20.79,42.54 IC9.8
  Bottom 0.254: v20.79,33.65 18.25,33.65 15.71,31.11 3.01,31.11 3.01,33.65 6.82,33.65 8.09,34.92 IC9.2
N$45  (via drill 0.61)
  Top 0.254: v67.78,19.68 67.78,33.65 66.51,34.92 62.7,34.92 62.7,56.51 61.43,57.78 57.62,57.78 57.62,62.86 58.89,64.13 58.89,71.75 SV1.28
  Bottom 0.254: v67.78,19.68 65.24,19.68 63.97,18.41 47.46,18.41 46.19,19.68 27.14,19.68 27.14,24.76 30.95,28.57 34.76,28.57 34.76,29.84 27.14,37.46 23.33,37.46 22.06,38.73 4.28,38.73 4.28,45.08 5.55,46.35 10.63,46.35 11.9,47.62 13.17,47.62 IC4.4
N$47  (via drill 0.61)
  Top 0.254: v37.3,48.89 37.3,59.05 38.57,60.32 42.38,60.32 v42.38,61.59 | v50,61.59 50,67.94 48.73,69.21 48.73,71.75 SV1.20
  Bottom 0.254: v42.38,61.59 v50,61.59 | PIC16C74.6 v37.3,48.89
N$48  (via drill 0.61)
  Top 0.254: v30.95,56.51 v30.95,64.13 | v44.92,64.13 47.46,66.67 47.46,67.94 46.19,69.21 46.19,71.75 SV1.18
  Bottom 0.254: v30.95,56.51 25.87,51.43 PIC16C74.5 | v30.95,64.13 v44.92,64.13
N$51  (via drill 0.61)
  Top 0.254: SV1.14 43.65,71.75 43.65,69.21 | 43.65,69.21 v46.19,66.67 | v36.03,43.81 36.03,60.32 43.65,67.94 43.65,69.21
  Bottom 0.254: 15.71,42.54 14.44,41.27 9.36,41.27 8.09,42.54 IC9.13 | v46.19,66.67 56.35,66.67 R8.1 | 15.71,42.54 16.98,41.27 22.06,41.27 23.33,42.54 25.87,42.54 27.14,43.81 v36.03,43.81 | 15.71,42.54 IC9.10
VCC  (via drill 0.61)
  Top 0.635: 6.82,46.35 5.55,45.08 IC9.14 | 6.82,46.35 6.82,53.97 5.55,55.24 IC4.14 5.55,57.78 8.09,60.32 10.63,60.32 10.63,64.13 IC7.8 | 6.82,46.35 6.82,29.84 R9.2 8.09,23.49 8.09,17.14 QG1.14 | R6.2 19.52,6.98 v15.71,6.98 | C5.1 85.56,45.08 88.1,42.54 88.1,41.27 90.64,41.27 90.64,43.81 IC6.3 | C6.1 v85.56,32.38 | v74.13,31.11 v74.13,14.6 | SV1.34 70.32,70.48 R2.2 | IC2.32 61.43,59.05 62.7,60.32 R8.2 67.78,60.32 v67.78,47.62 | v53.81,59.05 R10.2 | R1.1 28.41,38.73 25.87,36.19 PIC16C74.11
  Bottom 0.635: POWER.A 36.03,6.98 29.68,6.98 | 29.68,6.98 28.41,5.71 28.41,3.17 R4.2 | R6.2 23.33,6.98 29.68,6.98 | 9.36,13.33 QG1.14 | 9.36,13.33 C7.1 3.01,13.33 R5.2 | PIC16C74.32 38.57,41.27 37.3,40 8.09,40 5.55,42.54 IC9.14 | 9.36,13.33 v15.71,6.98 | IC3.16 90.64,27.3 v85.56,32.38 75.4,32.38 v74.13,31.11 | C3.2 77.94,14.6 v74.13,14.6 | C6.1 90.64,36.19 90.64,43.81 IC6.3 | IC5.14 IC1.32 79.21,59.05 77.94,57.78 62.7,57.78 61.43,59.05 IC2.32 v53.81,59.05 | R2.2 R8.2 58.89,69.21 39.84,69.21 38.57,67.94 | 14.44,65.4 13.17,64.13 IC7.8 | 14.44,65.4 R1.1 | R11.2 41.11,65.4 38.57,67.94 | 38.57,67.94 16.98,67.94 14.44,65.4 | v67.78,47.62 C5.1

### Text on the board
Top: 1 | + | 1 | 1 | 1 | 1 | 1 | 1 | 1 | + | 1 | + | + | 1 | + | 1 | + | R 1.5 - (c) 2003 | + | + | Semi-Virtual Drive